# EAGLE design stlink (EAGLE 7.5.0)
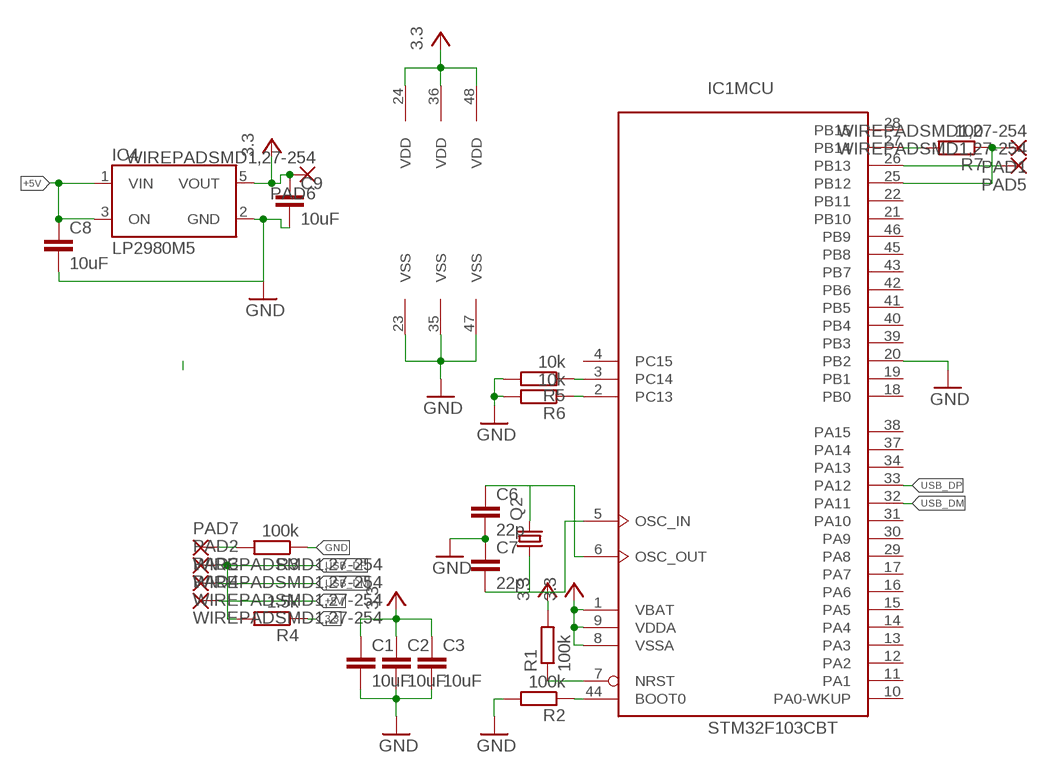
[diagram p0: schematic, sheet 1]

## Parts
C1  10uF  C-EUC0805  [C0805]
C2  10uF  C-EUC0805  [C0805]
C3  10uF  C-EUC0805  [C0805]
C6  22p  C-EUC0805  [C0805]
C7  22p  C-EUC0805  [C0805]
C8  10uF  C-EUC0805  [C0805]
C9  10uF  C-EUC0805  [C0805]
IC1  STM32F103CBT  [LQFP48]
IC4  LP2980M5  [SOT23-5]
PAD1  WIREPADSMD1,27-254  [SMD1,27-2,54]
PAD2  WIREPADSMD1,27-254  [SMD1,27-2,54]
PAD3  WIREPADSMD1,27-254  [SMD1,27-2,54]
PAD4  WIREPADSMD1,27-254  [SMD1,27-2,54]
PAD5  WIREPADSMD1,27-254  [SMD1,27-2,54]
PAD6  WIREPADSMD1,27-254  [SMD1,27-2,54]
PAD7  WIREPADSMD1,27-254  [SMD1,27-2,54]
Q2  CRYSTALCTS406  [CTS406]
R1  100k  R-EU_R0805  [R0805]
R2  100k  R-EU_R0805  [R0805]
R3  100k  R-EU_R0805  [R0805]
R4  1.5k  R-EU_R0805  [R0805]
R5  10k  R-EU_R0805  [R0805]
R6  10k  R-EU_R0805  [R0805]
R7  100  R-EU_R0805  [R0805]

## Nets
3.3: R4.1
+5V: C8.1 IC4.1(VIN) IC4.3(ON) PAD4.1(P)
GND: C1.2 C2.2 C3.2 C6.2 C7.1 C8.2 C9.2 IC1.20(MCU:PB2) IC1.23(PWR:VSS) IC1.35(PWR:VSS) IC1.47(PWR:VSS) IC4.2(GND) R2.2 R3.1 R5.2 R6.2
N$1: C6.1 IC1.6(MCU:OSC_OUT) Q2.3
N$2: IC1.7(MCU:NRST) R1.1
N$3: C7.2 IC1.5(MCU:OSC_IN) Q2.1
N$4: IC1.44(MCU:BOOT0) R2.1
N$5: IC1.27(MCU:PB14) R7.2
N$6: IC1.26(MCU:PB13) PAD5.1(P)
N$7: PAD7.1(P) R3.2
N$8: IC1.3(MCU:PC14) R5.1
N$9: IC1.2(MCU:PC13) R6.1
N$10: IC1.25(MCU:PB12) PAD1.1(P) R7.1
USB_DM: IC1.32(MCU:PA11) PAD3.1(P)
USB_DP: IC1.33(MCU:PA12) PAD2.1(P) R4.2
VCC: C1.1 C2.1 C3.1 C9.1 IC1.1(MCU:VBAT) IC1.8(MCU:VSSA) IC1.9(MCU:VDDA) IC1.24(PWR:VDD) IC1.36(PWR:VDD) IC1.48(PWR:VDD) IC4.5(VOUT) PAD6.1(P) R1.2 ; supply symbol labelled 3.3
Unconnected: IC1.4(MCU:PC15) IC1.10(MCU:PA0-WKUP) IC1.11(MCU:PA1) IC1.12(MCU:PA2) IC1.13(MCU:PA3) IC1.14(MCU:PA4) IC1.15(MCU:PA5) IC1.16(MCU:PA6) IC1.17(MCU:PA7) IC1.18(MCU:PB0) IC1.19(MCU:PB1) IC1.21(MCU:PB10) IC1.22(MCU:PB11) IC1.28(MCU:PB15) IC1.29(MCU:PA8) IC1.30(MCU:PA9) IC1.31(MCU:PA10) IC1.34(MCU:PA13) IC1.37(MCU:PA14) IC1.38(MCU:PA15) IC1.39(MCU:PB3) IC1.40(MCU:PB4) IC1.41(MCU:PB5) IC1.42(MCU:PB6) IC1.43(MCU:PB7) IC1.45(MCU:PB8) IC1.46(MCU:PB9)

## Library data of the parts
C1-C3 C6-C9 = rcl:C-EU: CAPACITOR, European symbol
IC1 = micro-stm_v3:STM32F103C*T: ARM 32-bit Cortex™-M3 CPU 72 MHz maximum frequency 16 to 128 Kbytes of Flash memory 6 to 20 kbytes of SRAM 37 GPIOs 2.0 to 3.6 V application supply
IC4 = v-reg-3:LP2980: National Semiconductor <http://www.national.com> Micropower Linear Regulator 50mA regulated output, Vin 16V max., ultra-low dropout of 120mV @ 50mA, 1µA standby current
PAD1-PAD7 = wirepad:WIREPAD: Wire PAD connect wire on PCB
Q2 = crystal:CRYSTAL: CRYSTAL; OC_FARNELL: unknown; OC_NEWARK: unknown
R1-R7 = rcl:R-EU_: RESISTOR, European symbol

## Board
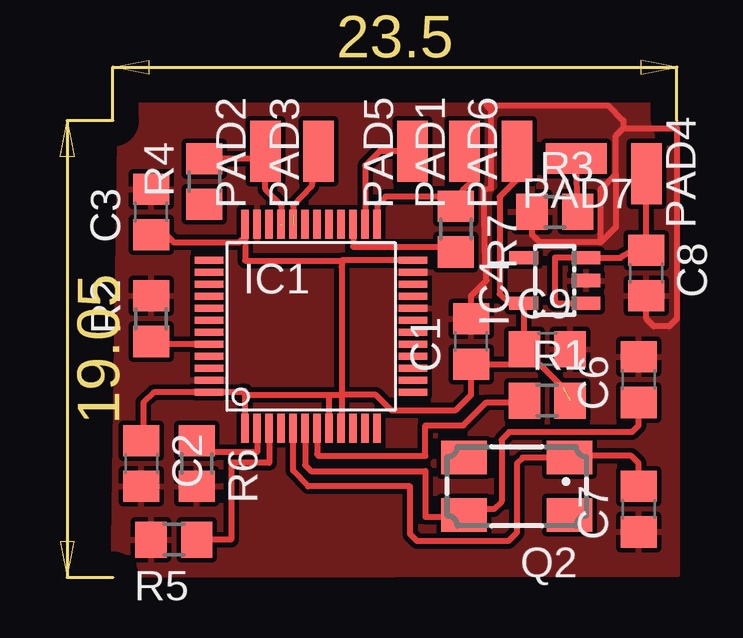
[diagram p1: board, top side]

Size 25.7 x 21.57 mm. Coordinates in mm from the lower left corner, seen from the top.
Copper layers (1*16): Top 0.035mm / dielectric 1.5mm / Bottom 0.035mm
Design rules "default *": minimum track width 0.2mm, minimum drill 0.2mm, track to track 0.2mm, track to pad 0.2mm, pad to pad 0.2mm, via to via 0.2mm, smd to smd 0.2mm, copper to edge 40mil, drill to drill 8mil, minimum pad ring 10mil, minimum via ring 8mil, stop-mask expansion 4mil, vias tented up to drill 0mil, thermal gap 0.2mm

### Footprints (pad centres in the part's own frame; a part is rotated, then mirrored left to right if it is on the bottom)
C0805 = smd 1.3 x 1.5: 1 -0.95,0; 2 0.95,0
LQFP48 = smd 0.3 x 1.2: 1 -2.75,-4.25; 2 -2.25,-4.25; 3 -1.75,-4.25; 4 -1.25,-4.25; 5 -0.75,-4.25; 6 -0.25,-4.25; 7 0.25,-4.25; 8 0.75,-4.25; 9 1.25,-4.25; 10 1.75,-4.25; 11 2.25,-4.25; 12 2.75,-4.25; 25 2.75,4.25; 26 2.25,4.25; 27 1.75,4.25; 28 1.25,4.25; 29 0.75,4.25; 30 0.25,4.25; 31 -0.25,4.25; 32 -0.75,4.25; 33 -1.25,4.25; 34 -1.75,4.25; 35 -2.25,4.25; 36 -2.75,4.25 | smd 1.2 x 0.3: 13 4.25,-2.75; 14 4.25,-2.25; 15 4.25,-1.75; 16 4.25,-1.25; 17 4.25,-0.75; 18 4.25,-0.25; 19 4.25,0.25; 20 4.25,0.75; 21 4.25,1.25; 22 4.25,1.75; 23 4.25,2.25; 24 4.25,2.75; 37 -4.25,2.75; 38 -4.25,2.25; 39 -4.25,1.75; 40 -4.25,1.25; 41 -4.25,0.75; 42 -4.25,0.25; 43 -4.25,-0.25; 44 -4.25,-0.75; 45 -4.25,-1.25; 46 -4.25,-1.75; 47 -4.25,-2.25; 48 -4.25,-2.75
SOT23-5 = smd 0.55 x 1.2: 1 -0.95,-1.3; 2 0,-1.3; 3 0.95,-1.3; 4 0.95,1.3; 5 -0.95,1.3
SMD1,27-2,54 = smd 1.27 x 2.54: 1 0,0
CTS406 = smd 1.9 x 1.4: 1 -2.2,-1.2; 2 2.2,-1.2; 3 2.2,1.2; 4 -2.2,1.2
R0805 = smd 1.3 x 1.5: 1 -0.95,0; 2 0.95,0

### Placement (x,y rotation side)
C1  17.13,9.84 90 top
C2  3.4,4.76 270 top
C3  3.79,15.24 90 top
C6  24.11,8.26 90 top
C7  24.11,2.86 90 top
C8  24.43,12.7 270 top
C9  20.3,9.53 0 top
IC1  10.46,10.48 0 top
IC4  20.62,12.38 90 top
PAD1  16.86,17.78 0 top
PAD2  8.55,17.78 0 top
PAD3  10.78,17.78 0 top
PAD4  24.43,16.83 180 top
PAD5  14.7,17.78 0 top
PAD6  19.03,17.78 0 top
PAD7  21.51,17.46 90 top
Q2  19.03,3.81 180 top
R1  20.3,7.38 0 top
R2  3.79,10.79 90 top
R3  20.62,15.24 0 top
R4  6.02,16.51 90 top
R5  4.75,1.59 180 top
R6  5.7,4.76 270 top
R7  16.49,14.53 270 top

### Tracks (layer width: path | path; a pad name or v marks a point on that pad's centre or on a via)
+5V  (1 unrouted)
  Top 0.254: C8.1 arc45 23.35,13.33 IC4.3 20.62,13.33 20.62,13.34 20.62,11.43 IC4.1 | C8.1 PAD4.1
GND
  Top 0.254: C1.2 17.13,11.75 17.76,12.38 17.76,12.81 17.72,13.02 17.66,16.19 17.96,16.22 17.96,19.48 17.76,19.68 22.84,19.68 23.48,19.05 23.48,18.73 | 23.16,16.83 23.16,14.61 22.53,13.97 | 22.53,13.97 19.99,13.97 19.67,14.29 R3.1 | 22.53,13.97 22.53,16.19 23.16,16.83 | 23.16,16.83 23.16,18.41 23.48,18.73 | 23.48,18.73 25.7,18.73 25.7,10.79 25.38,10.48 24.75,10.48 24.43,10.79 C8.2
  pour Top: 2.52,19.68 25.7,19.68 25.7,0.14 2.23,0.11
N$1
  Top 0.254: IC1.6 10.21,4.7 10.46,4.45 15.22,4.45 15.22,2.54 16.76,2.54 Q2.3 17.08,2.86 18.08,2.86 18.4,3.17 18.4,5.75 18.71,6.06 23.83,6.06 24.11,6.35 C6.1
N$2
  Top 0.254: IC1.7 10.71,5.15 10.78,5.08 15.22,5.08 15.22,6.35 16.81,6.35 17.76,7.3 19.28,7.3 R1.1
N$3
  Top 0.254: C7.2 24.11,4.76 23.8,5.08 21.3,5.08 Q2.1 19.28,5.01 19.03,4.76 19.03,1.87 18.69,1.53 14.88,1.53 14.59,1.82 14.59,3.81 10.34,3.81 9.71,4.46 9.71,6.2 IC1.5
N$4
  Top 0.254: IC1.44 3.91,9.73 R2.1
N$5
  Top 0.254: IC1.27 12.21,13.8 12.2,13.79 16.59,13.79 R7.2
N$6
  Top 0.254: PAD5.1 13.32,17.78 12.71,17.17 12.71,14.79 IC1.26
N$7  (1 unrouted)
  Top 0.254: R3.2 PAD7.1
N$8
  Top 0.254: IC1.3 8.71,4.78 7.13,4.78 7.13,1.59 R5.1
N$9
  Top 0.254: IC1.2 8.21,5.24 5.46,5.24 5.78,5.71 R6.1
N$10
  Top 0.254: IC1.25 13.22,14.74 13.22,15.54 13.56,15.88 16.17,15.88 16.57,15.48 R7.1 16.81,16.19 17.13,16.51 PAD1.1
USB_DM  (1 unrouted)
  Top 0.254: PAD3.1 10.46,16.28 9.71,15.51 9.71,15.09
USB_DP  (2 unrouted)
  Top 0.254: 6.33,17.78 R4.2 | 9.23,14.7 9.23,15.51 8.56,16.19 PAD2.1 8.24,17.46 R4.2
VCC  (1 unrouted)
  Top 0.254: 11.73,7.62 13.16,7.62 13.79,6.99 16.49,6.99 17.13,7.62 C1.1 18.91,8.89 | 11.73,7.62 11.73,6.25 IC1.9 | IC1.8 11.21,7.62 | 11.21,7.62 11.73,7.62 | IC1.1 7.71,7.62 | 7.71,7.62 7.71,7.78 7.6,7.78 7.6,7.73 IC1.48 3.9,7.73 3.48,7.3 3.48,5.79 C2.1 | 7.71,7.62 11.21,7.62 | 11.73,12.94 11.73,13.21 7.71,13.21 7.71,14.21 | 11.73,12.94 11.73,7.62 | IC1.36 7.71,14.21 | C3.1 4.42,14.29 4.75,13.97 7.47,13.97 7.71,14.21 | IC1.24 11.76,13.23 11.73,12.94 | 18.91,8.89 arc45 C9.1 19.32,9.56 IC4.5 18.71,11.43 18.32,11.82 18.32,15.87 19.03,16.57 PAD6.1 | 18.91,8.89 19.98,8.89 20.94,7.94